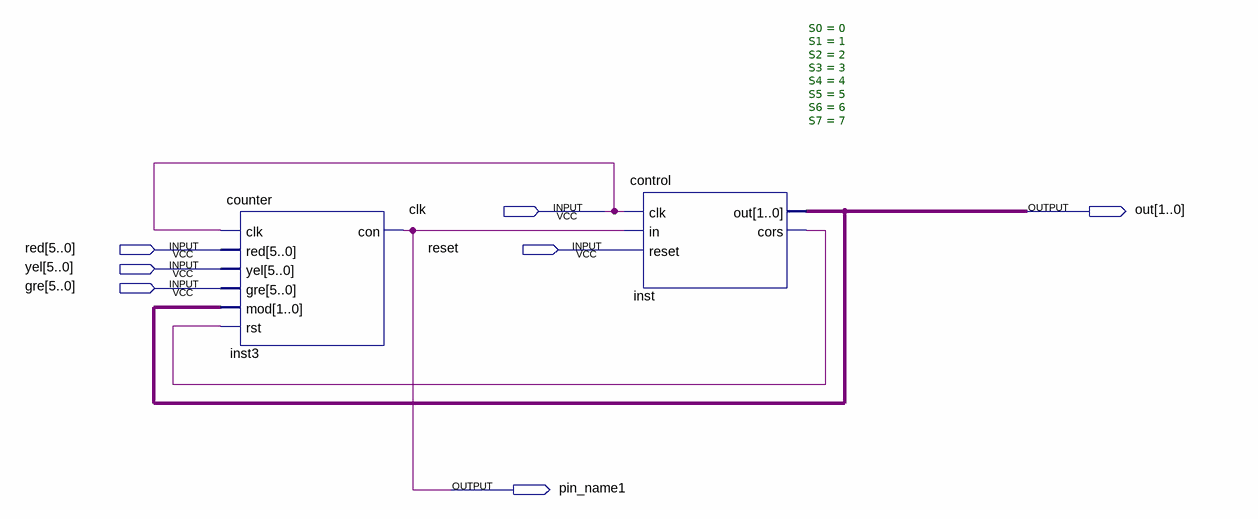
[diagram p0: schematic sheet]
// Quartus schematic red.bdf as structural Verilog: 2 symbols, 7 pins
module red (
  input  clk,
  input  [5:0] red,
  input  reset,
  input  [5:0] yel,
  input  [5:0] gre,
  output [1:0] out,
  output pin_name1
);

  wire inst_cors;

  counter inst3 (.clk(clk), .red(red), .yel(yel), .gre(gre), .mod(out), .rst(inst_cors), .con(pin_name1));
  control #(.S0(0), .S1(1), .S2(2), .S3(3), .S4(4), .S5(5), .S6(6), .S7(7)) inst (
    .clk(clk), .in(pin_name1), .reset(reset), .out(out), .cors(inst_cors));
endmodule
